# Altium schematic sheet MCU.SchDoc
size A3; SheetNumber: 2; SheetTotal: 4
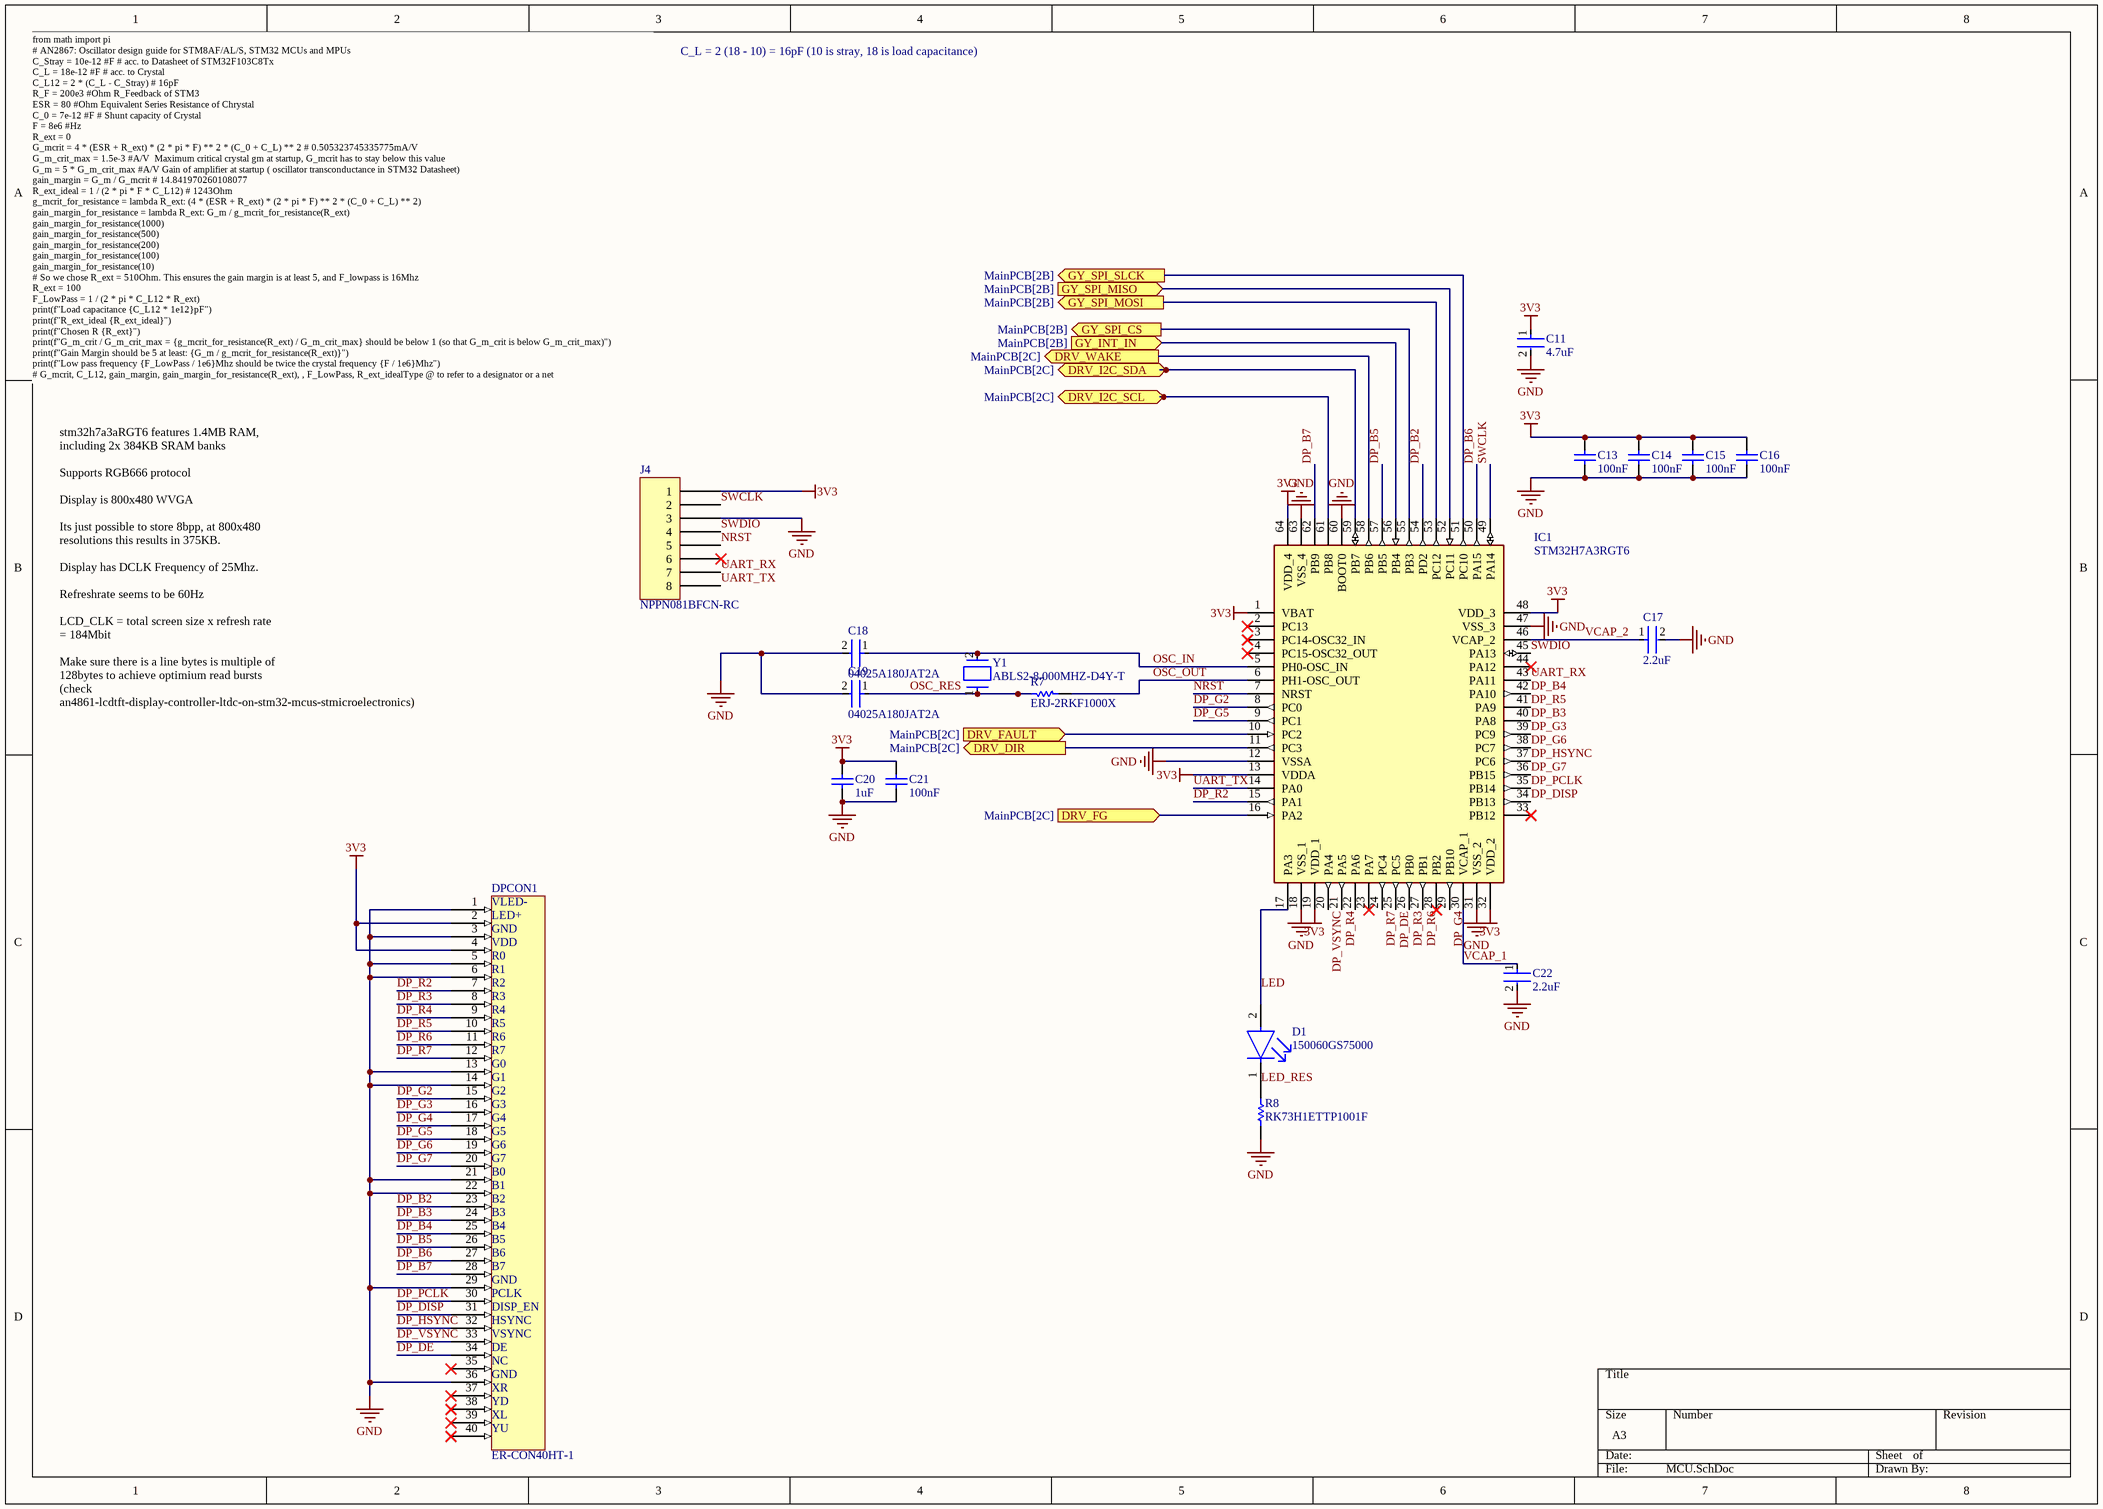
[diagram p0: MCU.SchDoc]

## Parts
C11  4.7uF  [FP-C1005-050-0_15-MFG]
C13  100nF  [CAPC1005X56X25LL10T15]
C14  100nF  [CAPC1005X56X25LL10T15]
C15  100nF  [CAPC1005X56X25LL10T15]
C16  100nF  [CAPC1005X56X25LL10T15]
C17  2.2uF  [FP-C1005-050-0_05-IPC_A]
C18  04025A180JAT2A  [FP-0402-L_1_0_1-W_0_5_0_1-MFG]
C19  04025A180JAT2A  [FP-0402-L_1_0_1-W_0_5_0_1-MFG]
C20  1uF  [CAPC1005X60X30NL05T10]
C21  100nF  [CAPC1005X56X25LL10T15]
C22  2.2uF  [FP-C1005-050-0_05-IPC_A]
D1  150060GS75000  [FP-150060GS75000-MFG]
DPCON1  ER-CON40HT-1  [ER-CON40HT-1]
IC1  STM32H7A3RGT6  [QFP50P1200X1200X160-64N]
J4  NPPN081BFCN-RC  [SULLINS NPPN081BFCN]
R7  ERJ-2RKF1000X  [RESC1005X40X25LL05T05]
R8  RK73H1ETTP1001F  [RESC1005X40X25LL10T10]
Y1  ABLS2-8.000MHZ-D4Y-T  [FP-ABLS2-MFG]

## Ports
DRV_DIR (out, see MainPCB[2C]), DRV_FAULT (in, see MainPCB[2C]), DRV_FG (in, see MainPCB[2C]), DRV_I2C_SCL (bidir, see MainPCB[2C]), DRV_I2C_SDA (bidir, see MainPCB[2C]), DRV_WAKE (out, see MainPCB[2C]), GY_INT_IN (in, see MainPCB[2B]), GY_SPI_CS (out, see MainPCB[2B]), GY_SPI_MISO (in, see MainPCB[2B]), GY_SPI_MOSI (out, see MainPCB[2B]), GY_SPI_SLCK (out, see MainPCB[2B])

## Nets
3V3: C11.1 C13.2 C14.2 C15.2 C16.2 C20.2 C21.2 DPCON1.2 DPCON1.4 IC1.1(VBAT) IC1.13(VDDA) IC1.19(VDD_1) IC1.32(VDD_2) IC1.48(VDD_3) IC1.64(VDD_4) J4.1
GND: C11.2 C13.1 C14.1 C15.1 C16.1 C17.2 C18.2 C19.2 C20.1 C21.1 C22.2 DPCON1.1 DPCON1.3 DPCON1.5 DPCON1.6 DPCON1.13 DPCON1.14 DPCON1.21 DPCON1.22 DPCON1.29 DPCON1.36 IC1.12(VSSA) IC1.18(VSS_1) IC1.31(VSS_2) IC1.47(VSS_3) IC1.60(BOOT0) IC1.63(VSS_4) J4.3 R8.1
DP_B2: DPCON1.23 IC1.54(PD2)
DP_B3: DPCON1.24 IC1.40(PA8)
DP_B4: DPCON1.25 IC1.42(PA10)
DP_B5: DPCON1.26 IC1.57(PB5)
DP_B6: DPCON1.27 IC1.50(PA15)
DP_B7: DPCON1.28 IC1.62(PB9)
DP_DE: DPCON1.34 IC1.25(PC5)
DP_DISP: DPCON1.31 IC1.34(PB13)
DP_G2: DPCON1.15 IC1.8(PC0)
DP_G3: DPCON1.16 IC1.39(PC9)
DP_G4: DPCON1.17 IC1.29(PB10)
DP_G5: DPCON1.18 IC1.9(PC1)
DP_G6: DPCON1.19 IC1.38(PC7)
DP_G7: DPCON1.20 IC1.36(PB15)
DP_HSYNC: DPCON1.32 IC1.37(PC6)
DP_PCLK: DPCON1.30 IC1.35(PB14)
DP_R2: DPCON1.7 IC1.15(PA1)
DP_R3: DPCON1.8 IC1.26(PB0)
DP_R4: DPCON1.9 IC1.21(PA5)
DP_R5: DPCON1.10 IC1.41(PA9)
DP_R6: DPCON1.11 IC1.27(PB1)
DP_R7: DPCON1.12 IC1.24(PC4)
DP_VSYNC: DPCON1.33 IC1.20(PA4)
DRV_DIR: IC1.11(PC3) ; port DRV_DIR
DRV_FAULT: IC1.10(PC2) ; port DRV_FAULT
DRV_FG: IC1.16(PA2) ; port DRV_FG
DRV_I2C_SCL: IC1.61(PB8) ; port DRV_I2C_SCL
DRV_I2C_SDA: IC1.59(PB7) ; port DRV_I2C_SDA
DRV_WAKE: IC1.58(PB6) ; port DRV_WAKE
GY_INT_IN: IC1.56(PB4) ; port GY_INT_IN
GY_SPI_CS: IC1.55(PB3) ; port GY_SPI_CS
GY_SPI_MISO: IC1.52(PC11) ; port GY_SPI_MISO
GY_SPI_MOSI: IC1.53(PC12) ; port GY_SPI_MOSI
GY_SPI_SLCK: IC1.51(PC10) ; port GY_SPI_SLCK
LED: D1.2(A) IC1.17(PA3)
LED_RES: D1.1(C) R8.2
NRST: IC1.7(NRST) J4.5
OSC_IN: C18.1 IC1.5(PH0-OSC_IN) Y1.2
OSC_OUT: IC1.6(PH1-OSC_OUT) R7.1
OSC_RES: C19.1 R7.2 Y1.1
SWCLK: IC1.49(PA14) J4.2
SWDIO: IC1.45(PA13) J4.4
UART_RX: IC1.43(PA11) J4.7
UART_TX: IC1.14(PA0) J4.8
VCAP_1: C22.1 IC1.30(VCAP_1)
VCAP_2: C17.1 IC1.46(VCAP_2)

Not connected (* = marked no-connect by the designer): DPCON1 35* 37* 38* 39* 40*; IC1 2(PC13)* 3(PC14-OSC32_IN)* 4(PC15-OSC32_OUT)* 22(PA6) 23(PA7)* 28(PB2)* 33(PB12)* 44(PA12)*; J4 6*

## Notes on the sheet
- C_L = 2 (18 - 10) = 16pF (10 is stray, 18 is load capacitance)
- from math import pi
  # AN2867: Oscillator design guide for STM8AF/AL/S, STM32 MCUs and MPUs
  C_Stray = 10e-12 #F # acc. to Datasheet of STM32F103C8Tx
  C_L = 18e-12 #F # acc. to Crystal
  C_L12 = 2 * (C_L - C_Stray) # 16pF
  R_F = 200e3 #Ohm R_Feedback of STM3
  ESR = 80 #Ohm Equivalent Series Resistance of Chrystal
  C_0 = 7e-12 #F # Shunt capacity of Crystal
  F = 8e6 #Hz
  R_ext = 0
  G_mcrit = 4 * (ESR + R_ext) * (2 * pi * F) ** 2 * (C_0 + C_L) ** 2 # 0.505323745335775mA/V
  G_m_crit_max = 1.5e-3 #A/V  Maximum critical crystal gm at startup, G_mcrit has to stay below this value
  G_m = 5 * G_m_crit_max #A/V Gain of amplifier at startup ( oscillator transconductance in STM32 Datasheet)
  gain_margin = G_m / G_mcrit # 14.841970260108077
  R_ext_ideal = 1 / (2 * pi * F * C_L12) # 1243Ohm
  g_mcrit_for_resistance = lambda R_ext: (4 * (ESR + R_ext) * (2 * pi * F) ** 2 * (C_0 + C_L) ** 2)
  gain_margin_for_resistance = lambda R_ext: G_m / g_mcrit_for_resistance(R_ext)
  gain_margin_for_resistance(1000)
  gain_margin_for_resistance(500)
  gain_margin_for_resistance(200)
  gain_margin_for_resistance(100)
  gain_margin_for_resistance(10)
  # So we chose R_ext = 510Ohm. This ensures the gain margin is at least 5, and F_lowpass is 16Mhz
  R_ext = 100
  F_LowPass = 1 / (2 * pi * C_L12 * R_ext)
  print(f"Load capacitance {C_L12 * 1e12}pF")
  print(f"R_ext_ideal {R_ext_ideal}")
  print(f"Chosen R {R_ext}")
  print(f"G_m_crit / G_m_crit_max = {g_mcrit_for_resistance(R_ext) / G_m_crit_max} should be below 1 (so that G_m_crit is below G_m_crit_max)")
  print(f"Gain Margin should be 5 at least: {G_m / g_mcrit_for_resistance(R_ext)}")
  print(f"Low pass frequency {F_LowPass / 1e6}Mhz should be twice the crystal frequency {F / 1e6}Mhz")
  # G_mcrit, C_L12, gain_margin, gain_margin_for_resistance(R_ext), , F_LowPass, R_ext_idealType @ to refer to a designator or a net
- stm32h7a3aRGT6 features 1.4MB RAM, including 2x 384KB SRAM banks
  Supports RGB666 protocol
  Display is 800x480 WVGA
  Its just possible to store 8bpp, at 800x480 resolutions this results in 375KB.
  Display has DCLK Frequency of 25Mhz.
  Refreshrate seems to be 60Hz
  LCD_CLK = total screen size x refresh rate = 184Mbit
  Make sure there is a line bytes is multiple of 128bytes to achieve optimium read bursts (check an4861-lcdtft-display-controller-ltdc-on-stm32-mcus-stmicroelectronics)
- (in symbol ER-CON40HT-1) VLED-; LED+; GND; VDD; R0; R1; R2; R3; R4; R5; R6; R7; G0; G1; G2; G3; G4; G5; G6; G7; B0; B1; B2; B3; B4; B5; B6; B7; PCLK; DISP_EN; HSYNC; VSYNC; DE; NC; XR; YD; XL; YU

## Library data of the parts
C11 = CMP-2000-05997-2: CAP CER 4.7UF 10V X5R 0402 C1005X5R1A475K050BC; Dielectric Material: Ceramic; Tolerance: 10%; Series: C; Package Quantity: 10000; Max Operating Temperature: 85°C; Case Code (Imperial): 0402; Lead Free: Lead Free; Voltage Rating (DC): 10V; Packaging: Cut Tape; Voltage Rating: 10V; Min Operating Temperature: -55°C; Dielectric: X5R; Thickness: 0.022inch; Width: 0.02inch; Case/Package: 0402; Case Code (Metric): 1005; Capacitance: 4.7uF; Length: 0.039inch; RoHS Compliant: Yes; REACH SVHC: No SVHC; Mount: Surface Mount
C13-C16 C21 = CMP-2008-02743-1: 04026D104KAT2A; Manufacturer: AVX Interconnect / Elco; Part Number: 04026D104KAT2A
C17 C22 = CMP-08246-002709-1: Multilayer Ceramic Capacitors 2.2μF ±10% 10V X5R SMD 0402 C1005X5R1A225K050BC; Packaging: Tape and Reel; REACH SVHC: No SVHC; Case Code (Imperial): 0402; Voltage Rating: 10V; Radiation Hardening: No; Construction: Flat; Case/Package: 0402; Width: 0.02inch; Length: 1mm; Dielectric Material: Ceramic; Series: C; Height: 0.5mm; Depth: 0.5mm; Thickness: 0.022inch; Tolerance: 10%; Package Quantity: 1; Case Code (Metric): 1005; Min Operating Temperature: -55°C; Dielectric: X5R; Number of Pins: 2; Mount: Surface Mount; Resistor Type: Ceramic; RoHS Compliant: Yes; Weight: 2.3E-05oz; Max Operating Temperature: 85°C; Lead Free: Lead Free; Voltage: 10V; Termination: SMD/SMT; Capacitance: 2.2uF; Voltage Rating (DC): 10V
C18 C19 = CMP-1034-00865-3: General Purpose Ceramic Capacitor, 0402, 18pF, 5%, C0G, 30ppm/°C, 50V; Insulation Resistance: 100GR; Length: 1mm; Voltage Rating (DC): 50V; Dielectric: C0G; Dielectric Material: Ceramic; Thickness: 0.022inch; Max Operating Temperature: 125°C; Min Operating Temperature: -55°C; RoHS Compliant: Yes; Package Quantity: 1; Mount: Surface Mount; Case Code (Imperial): 0402; REACH SVHC: No SVHC; Termination: SMD/SMT; Voltage: 50V; Number of Pins: 2; Contact Plating: Tin; Radiation Hardening: No; Voltage Rating: 50V; Capacitance: 18pF; Case Code (Metric): 1005; Case/Package: 0402; Tolerance: 5%; Packaging: Tape and Reel; Temperature Coefficient: 0ppm/°C; Depth: 0.5mm; Width: 0.02inch; Lead Free: Lead Free; Height: 0.5mm
C20 = CMP-2008-02056-1: C0402C105M8PACTU; Manufacturer: Kemet; Part Number: C0402C105M8PACTU
D1 = CMP-1426-00002-2: LED GREEN CLEAR 0603 SMD; Viewing Angle: 140°; Forward Current: 30mA; Dominant Wavelength: 520nm; Luminous Intensity: 430mcd; Lens Size: 0.7mm; Forward Voltage: 3.2V; Test Current: 20mA; Lens Color: Colorless; Case Code (Imperial): 0603; Case/Package: 0603; Case Code (Metric): 1608; Length: 1.6mm; Lens Style: Clear; Height: 0.8mm; RoHS Compliant: Yes; Package Quantity: 1; Max Operating Temperature: 85°C; Mount: Surface Mount; Wavelength: 520nm; Width: 0.8mm; Lens Transparency: Clear; Packaging: Cut Tape; Color: Green; Lead Free: Lead Free; Min Operating Temperature: -40°C; Series: WL-SMCW
DPCON1 = ER-CON40HT-1: Manufacturer: EastRising
IC1 = STM32H7A3RGT6: Integrated Circuit; Manufacturer_Name: STMicroelectronics; Datasheet Link: https://www.st.com/resource/en/datasheet/stm32h7a3ai.pdf; Height: 1.6mm; Manufacturer_Part_Number: STM32H7A3RGT6; Mouser Part Number: 511-STM32H7A3RGT6; Mouser Price/Stock: https://www.mouser.co.uk/ProductDetail/STMicroelectronics/STM32H7A3RGT6?qs=sPbYRqrBIVk%252BdecRlyVesQ%3D%3D
J4 = NPPN081BFCN-RC: CONN HDR 8POS 0.079 GOLD PCB; Manufacturer: Sullins Connector Solutions; Connector Type: Header; Contact Length - Post: 0.094" (2.40mm); Current Rating (Amps): 2A; Material Flammability Rating: UL94 V-0; Number of Positions: 8; Number of Positions Loaded: All; Pitch - Mating: 0.079" (2.00mm); Style: Board to Board; Part Number: NPPN081BFCN-RC; ComponentLink1Description: Datasheet; ComponentLink1URL: https://drawings-pdf.s3.amazonaws.com/10483.pdf; ComponentLink2Description: DigiKey Link; ComponentLink2URL: https://www.digikey.com/en/products/detail/sullins-connector-solutions/NPPN081BFCN-RC/804810; Contact Finish - Mating: Gold; Contact Finish - Post: Gold; Contact Finish Thickness - Mating: Flash; Contact Type: Female Socket; Fastening Type: Push-Pull; Insulation Color: Black; Insulation Height: 0.173" (4.40mm); LastUpdated: 21.06.2022 14:43:53; Lifecycle Status: Active; Minimum Order: 1; Mounting Type: Through Hole; Number of Rows: 1; Operating Temperature: -40°C ~ 105°C; Packaging: Tube; Part Status: Active; Price: 0.44; Series: -; Supplier 1: DigiKey; Supplier Part Number 1: S5751-08-ND; Termination: Solder
R7 = CMP-2002-00605-3: Chip Resistor, 100 Ohm, +/- 1%, 100 mW, -55 to 155 degC, 0402 (1005 Metric), RoHS, Tape and Reel; Manufacturer: Basic Passives; Power Rating: 100 mW; Resistance: 100 Ohm; Voltage Rating: 50 V; Case\/Package: 0402; Width: 0.5 mm; Pins: 2; ComponentLink2Description: Datasheet; PackageReference: 0402; Height: 0.35 mm; Tolerance: 1%; DatasheetVersion: 04/2015; Case Code (Imperial): 0402; Min Operating Temperature: -55 degC; Radiation Hardening: No; Length: 1 mm; Package Quantity: 10000; PackageDescription: 2-Pin Surface Mount Device, Body 1 x 0.5 mm; Mounting Technology: Surface Mount; Case Code (Metric): 1005; Packaging: Tape and Reel; ComponentLink1URL: http://www.panasonic.com/; RoHSCompliant: true; Max Operating Temperature: 155 degC; REACH SVHC: Yes; PartNumber: ERJ-2RKF1000X; ComponentLink1Description: Manufacturer URL; ComponentLink2URL: http://industrial.panasonic.com/cdbs/www-data/pdf/RDA0000/AOA0000C86.pdf; Mount: Surface Mount
R8 = CMP-2002-03808-1: Manufacturer: KOA Speer; Part Number: RK73H1ETTP1001F
Y1 = CMP-27762-001729-1: CRYSTAL 8.0000MHZ 18PF SMD; Series Resistance: 80R; Tolerance: 30ppm; Frequency: 8MHz; Operating Frequency: 8 MHz; Packaging: Tape and Reel; Number of Pins: 2; Mount: Surface Mount; Package Quantity: 1000; Series: ABLS2; Min Operating Temperature: -40°C; Termination: SMD/SMT; Load Capacitance: 18pF; Lead Free: Lead Free; Frequency Tolerance: 30ppm; RoHS Compliant: Yes; Length: 11.4mm; Width: 4.7mm; Height: 0.13inch; ESR (Equivalent Series Resistance): 80R; Max Operating Temperature: 85°C; Depth: 4.7mm; Frequency Stability: 30ppm